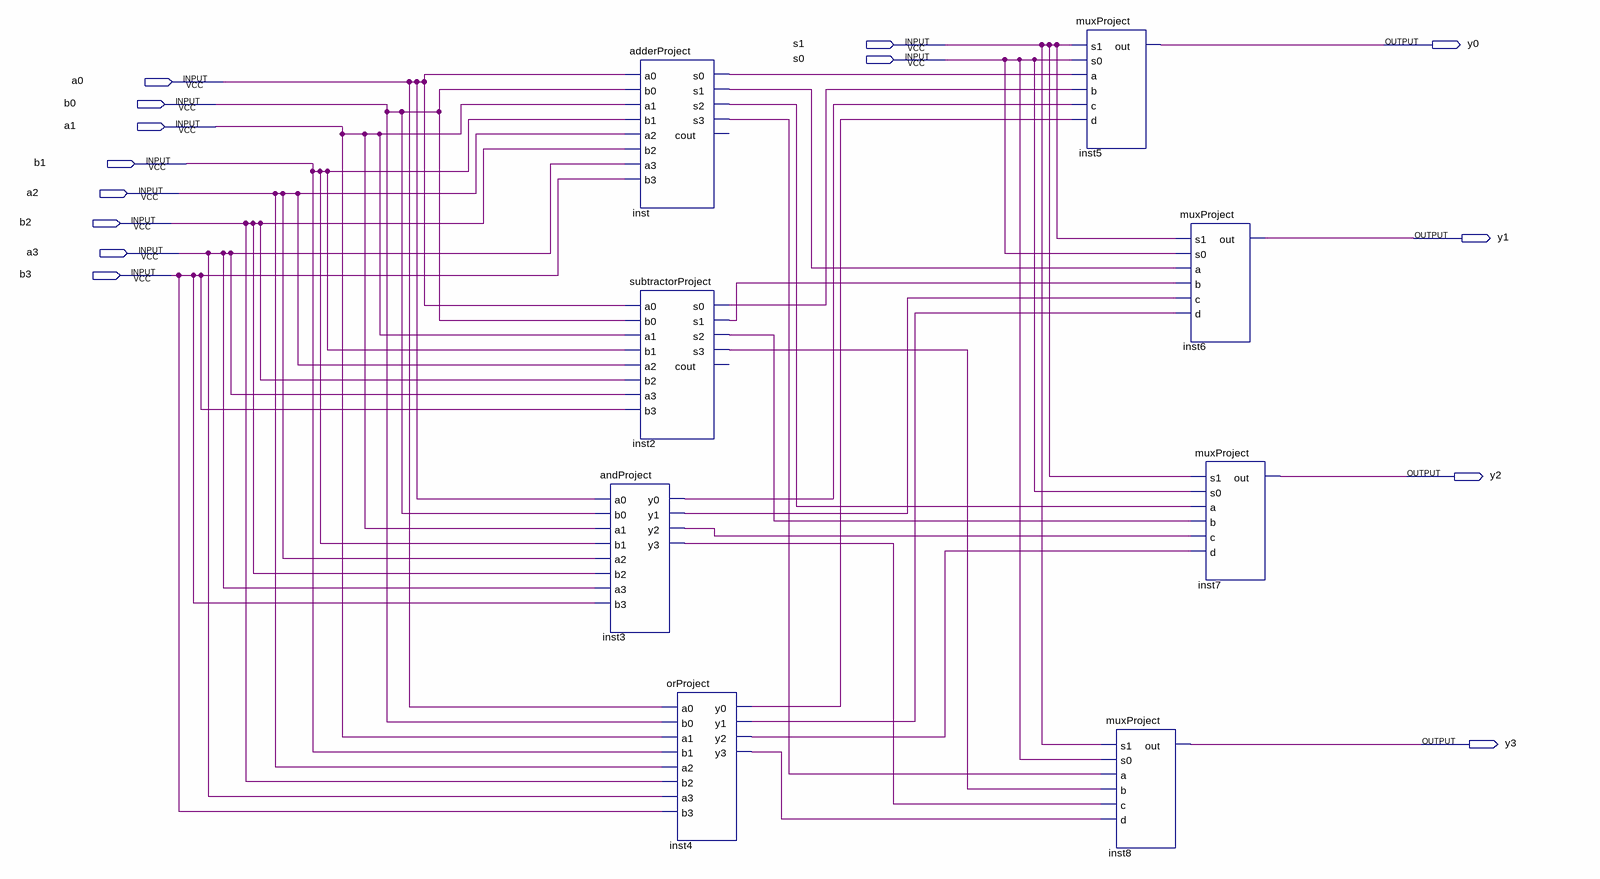
[diagram p0: schematic sheet]
// Quartus schematic aluProject.bdf as structural Verilog: 8 symbols, 14 pins
module aluProject (
  input  s1,
  input  s0,
  input  a0,
  input  b0,
  input  a1,
  input  b1,
  input  a2,
  input  b2,
  input  a3,
  input  b3,
  output y0,
  output y1,
  output y2,
  output y3
);

  wire inst2_s0, inst2_s1, inst2_s2, inst2_s3, inst3_y0, inst3_y1, inst3_y2, inst3_y3, inst4_y0, inst4_y1,
       inst4_y2, inst4_y3, inst_s0, inst_s1, inst_s2, inst_s3;

  adderProject inst (
    .a0(a0), .b0(b0), .a1(a1), .b1(b1), .a2(a2), .b2(b2), .a3(a3), .b3(b3), .s0(inst_s0), .s1(inst_s1),
    .s2(inst_s2), .s3(inst_s3));  // open: cout
  subtractorProject inst2 (
    .a0(a0), .b0(b0), .a1(a1), .b1(b1), .a2(a2), .b2(b2), .a3(a3), .b3(b3), .s0(inst2_s0), .s1(inst2_s1),
    .s2(inst2_s2), .s3(inst2_s3));  // open: cout
  andProject inst3 (
    .a0(a0), .b0(b0), .a1(a1), .b1(b1), .a2(a2), .b2(b2), .a3(a3), .b3(b3), .y0(inst3_y0), .y1(inst3_y1),
    .y2(inst3_y2), .y3(inst3_y3));
  orProject inst4 (
    .a0(a0), .b0(b0), .a1(a1), .b1(b1), .a2(a2), .b2(b2), .a3(a3), .b3(b3), .y0(inst4_y0), .y1(inst4_y1),
    .y2(inst4_y2), .y3(inst4_y3));
  muxProject inst5 (.s1(s1), .s0(s0), .a(inst_s0), .b(inst2_s0), .c(inst3_y0), .d(inst4_y0), .out(y0));
  muxProject inst8 (.s1(s1), .s0(s0), .a(inst_s3), .b(inst2_s3), .c(inst3_y3), .d(inst4_y3), .out(y3));
  muxProject inst6 (.s1(s1), .s0(s0), .a(inst_s1), .b(inst2_s1), .c(inst3_y1), .d(inst4_y1), .out(y1));
  muxProject inst7 (.s1(s1), .s0(s0), .a(inst_s2), .b(inst2_s2), .c(inst3_y2), .d(inst4_y2), .out(y2));
endmodule
